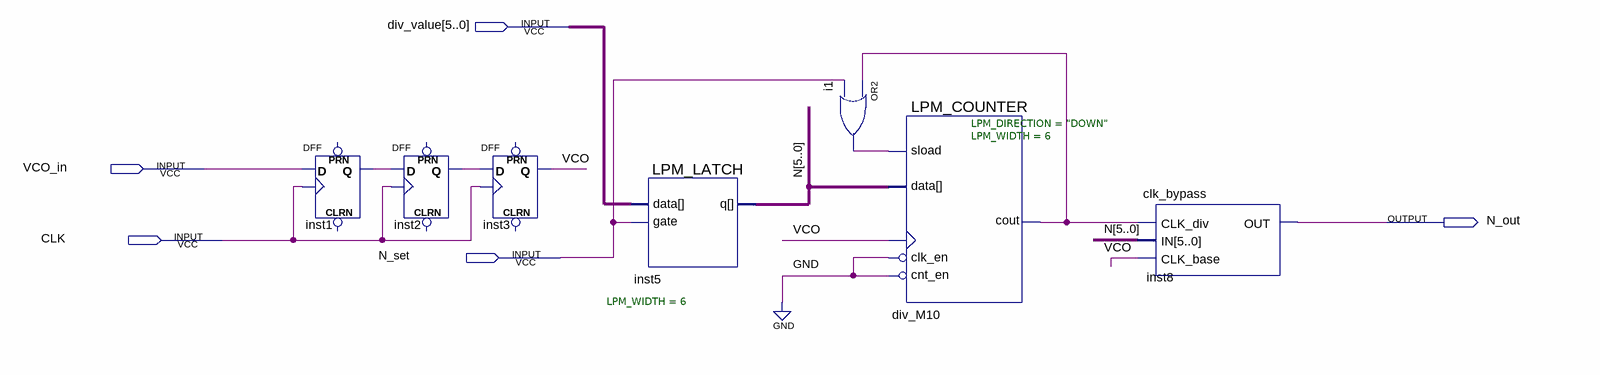
[diagram p0: schematic sheet]
// Quartus schematic variable_freqdiv.bdf as structural Verilog: 7 symbols, 5 pins
module variable_freqdiv (
  input  [5:0] div_value,
  input  VCO_in,
  input  CLK,
  input  N_set,
  output N_out
);

  wire div_M10_cout, i1_out, inst1_q, inst2_q, VCO;
  wire [5:0] N;

  DFF inst1 (.CLK(CLK), .D(VCO_in), .Q(inst1_q));  // open: CLRN, PRN
  DFF inst2 (.CLK(CLK), .D(inst1_q), .Q(inst2_q));  // open: CLRN, PRN
  DFF inst3 (.CLK(CLK), .D(inst2_q), .Q(VCO));  // open: CLRN, PRN
  LPM_LATCH #(.LPM_WIDTH(6)) inst5 (.data(div_value), .gate(N_set), .q(N));
  or i1 (i1_out, div_M10_cout, N_set);
  LPM_COUNTER #(.LPM_DIRECTION("DOWN"), .LPM_WIDTH(6)) div_M10 (
    .sload(i1_out), .data(N), .clock(VCO), .clk_en(~1'b0), .cnt_en(~1'b0), .cout(div_M10_cout));
  clk_bypass inst8 (.CLK_div(div_M10_cout), .IN(N), .CLK_base(VCO), .OUT(N_out));
endmodule
